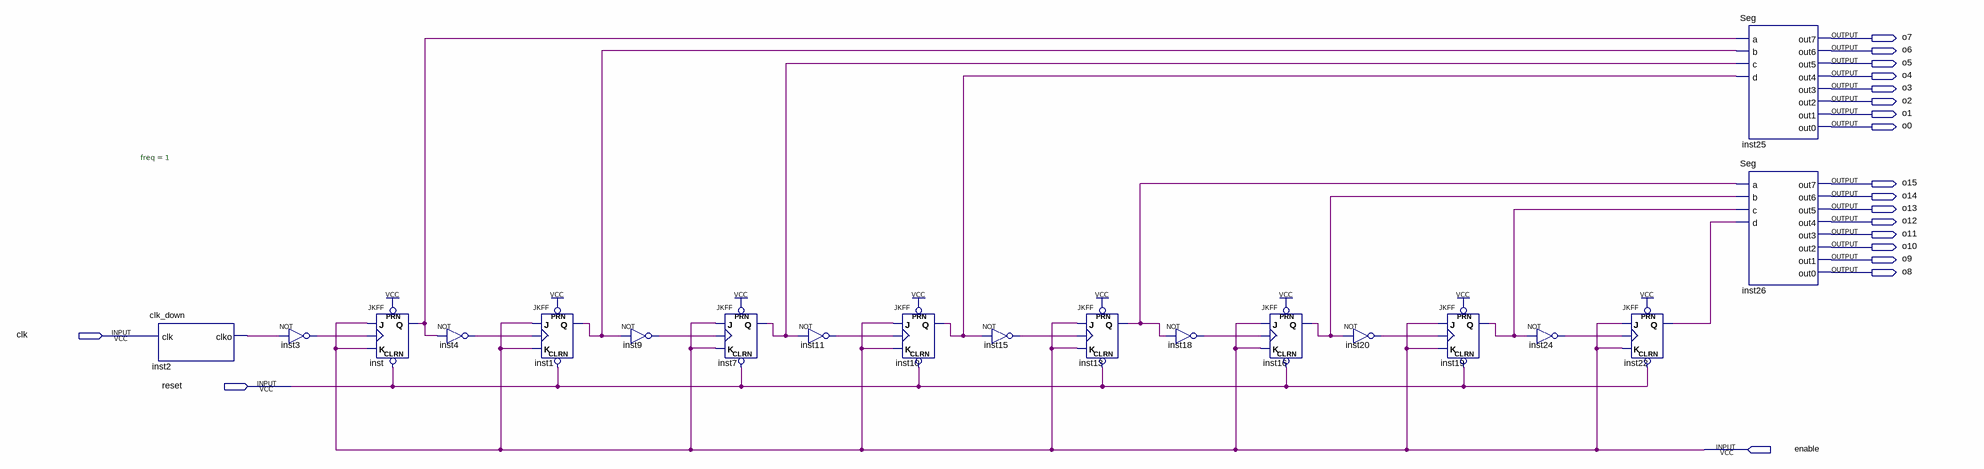
[diagram p0: schematic sheet]
// Quartus schematic ex7.bdf as structural Verilog: 19 symbols, 19 pins
module ex7 (
  input  clk,
  input  reset,
  input  enable,
  output o7,
  output o6,
  output o5,
  output o4,
  output o3,
  output o2,
  output o1,
  output o0,
  output o15,
  output o14,
  output o13,
  output o12,
  output o11,
  output o10,
  output o9,
  output o8
);

  wire inst1_q, inst2_clko, inst3_out, inst4_out, inst7_q, inst9_out, inst10_q, inst11_out, inst13_q,
       inst15_out, inst16_q, inst18_out, inst19_q, inst20_out, inst22_q, inst24_out, inst_q;

  clk_down #(.freq(1)) inst2 (.clk(clk), .clko(inst2_clko));
  not inst3 (inst3_out, inst2_clko);
  JKFF inst (.PRN(1'b1), .CLRN(reset), .K(enable), .J(enable), .CLK(inst3_out), .Q(inst_q));
  not inst4 (inst4_out, inst_q);
  JKFF inst1 (.PRN(1'b1), .CLRN(reset), .K(enable), .J(enable), .CLK(inst4_out), .Q(inst1_q));
  not inst9 (inst9_out, inst1_q);
  JKFF inst7 (.PRN(1'b1), .CLRN(reset), .K(enable), .J(enable), .CLK(inst9_out), .Q(inst7_q));
  not inst11 (inst11_out, inst7_q);
  JKFF inst10 (.PRN(1'b1), .CLRN(reset), .K(enable), .J(enable), .CLK(inst11_out), .Q(inst10_q));
  not inst15 (inst15_out, inst10_q);
  JKFF inst13 (.PRN(1'b1), .CLRN(reset), .K(enable), .J(enable), .CLK(inst15_out), .Q(inst13_q));
  not inst18 (inst18_out, inst13_q);
  JKFF inst16 (.PRN(1'b1), .CLRN(reset), .K(enable), .J(enable), .CLK(inst18_out), .Q(inst16_q));
  not inst20 (inst20_out, inst16_q);
  JKFF inst19 (.PRN(1'b1), .CLRN(reset), .K(enable), .J(enable), .CLK(inst20_out), .Q(inst19_q));
  not inst24 (inst24_out, inst19_q);
  JKFF inst22 (.PRN(1'b1), .CLRN(reset), .K(enable), .J(enable), .CLK(inst24_out), .Q(inst22_q));
  Seg inst25 (
    .a(inst_q), .b(inst1_q), .c(inst7_q), .d(inst10_q), .out7(o7), .out6(o6), .out5(o5), .out4(o4),
    .out3(o3), .out2(o2), .out1(o1), .out0(o0));
  Seg inst26 (
    .a(inst13_q), .b(inst16_q), .c(inst19_q), .d(inst22_q), .out7(o15), .out6(o14), .out5(o13), .out4(o12),
    .out3(o11), .out2(o10), .out1(o9), .out0(o8));
endmodule
